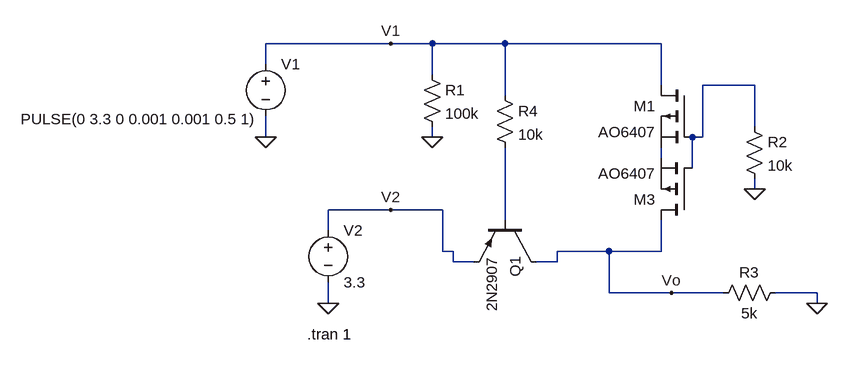
[diagram p0: schematic Power_Selector_5.asc]
Power_Selector_5.asc, the LTspice schematic file:
Version 4
SHEET 1 1032 680
WIRE 128 48 -64 48
WIRE 192 48 128 48
WIRE 304 48 192 48
WIRE 544 48 304 48
WIRE -64 80 -64 48
WIRE 192 96 192 48
WIRE 544 112 544 48
WIRE 688 112 608 112
WIRE 304 128 304 48
WIRE 688 176 688 112
WIRE -64 192 -64 160
WIRE 192 192 192 176
WIRE 608 192 608 112
WIRE 608 192 592 192
WIRE 544 224 544 208
WIRE 592 240 592 192
WIRE 688 272 688 256
WIRE 128 304 32 304
WIRE 208 304 128 304
WIRE 304 320 304 208
WIRE 32 336 32 304
WIRE 208 368 208 304
WIRE 224 368 208 368
WIRE 464 368 384 368
WIRE 544 368 544 320
WIRE 544 368 464 368
WIRE 224 384 224 368
WIRE 256 384 224 384
WIRE 384 384 384 368
WIRE 384 384 352 384
WIRE 464 432 464 368
WIRE 560 432 464 432
WIRE 640 432 560 432
WIRE 784 432 720 432
WIRE 32 448 32 416
WIRE 784 448 784 432
FLAG -64 192 0
FLAG 32 448 0
FLAG 192 192 0
FLAG 688 272 0
FLAG 560 432 Vo
FLAG 784 448 0
FLAG 128 48 V1
FLAG 128 304 V2
SYMBOL voltage -64 64 R0
WINDOW 3 -377 100 Left 2
WINDOW 123 0 0 Left 0
WINDOW 39 0 0 Left 0
SYMATTR Value PULSE(0 3.3 0 0.001 0.001 0.5 1)
SYMATTR InstName V1
SYMBOL voltage 32 320 R0
WINDOW 123 0 0 Left 0
WINDOW 39 0 0 Left 0
SYMATTR InstName V2
SYMATTR Value 3.3
SYMBOL res 176 80 R0
SYMATTR InstName R1
SYMATTR Value 100k
SYMBOL pmos 592 112 M0
SYMATTR InstName M1
SYMATTR Value AO6407
SYMBOL res 672 160 R0
SYMATTR InstName R2
SYMATTR Value 10k
SYMBOL res 736 416 R90
WINDOW 0 0 56 VBottom 2
WINDOW 3 32 56 VTop 2
SYMATTR InstName R3
SYMATTR Value 5k
SYMBOL res 288 112 R0
SYMATTR InstName R4
SYMATTR Value 10k
SYMBOL pmos 592 320 R180
SYMATTR InstName M3
SYMATTR Value AO6407
SYMBOL pnp 352 320 R90
SYMATTR InstName Q1
SYMATTR Value 2N2907
TEXT 0 496 Left 2 !.tran 1

The netlist it stands for:
* Power_Selector_5.asc
V1 V1 0 PULSE(0 3.3 0 0.001 0.001 0.5 1)
V2 V2 0 3.3
R1 V1 0 100k
M1 V1 N001 N002 N002 AO6407
R2 N001 0 10k
R3 0 Vo 5k
R4 V1 N003 10k
M3 Vo N001 N002 N002 AO6407
Q1 Vo N003 V2 0 2N2907
.model NPN NPN
.model PNP PNP
.lib standard.bjt
.model NMOS NMOS
.model PMOS PMOS
.lib standard.mos
.tran 1
.backanno
.end